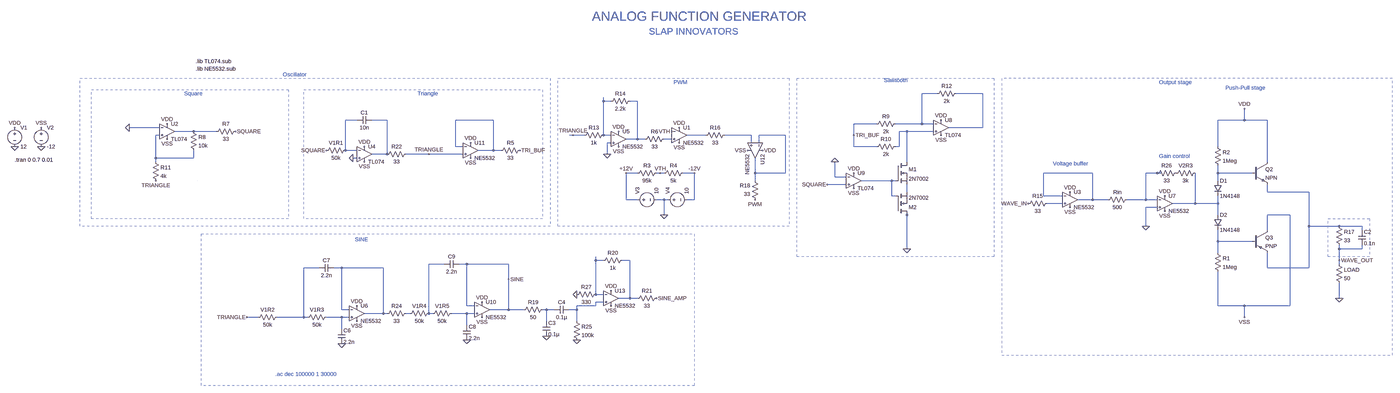
[diagram p0: schematic Function Generator Schematic.asc, whole sheet]
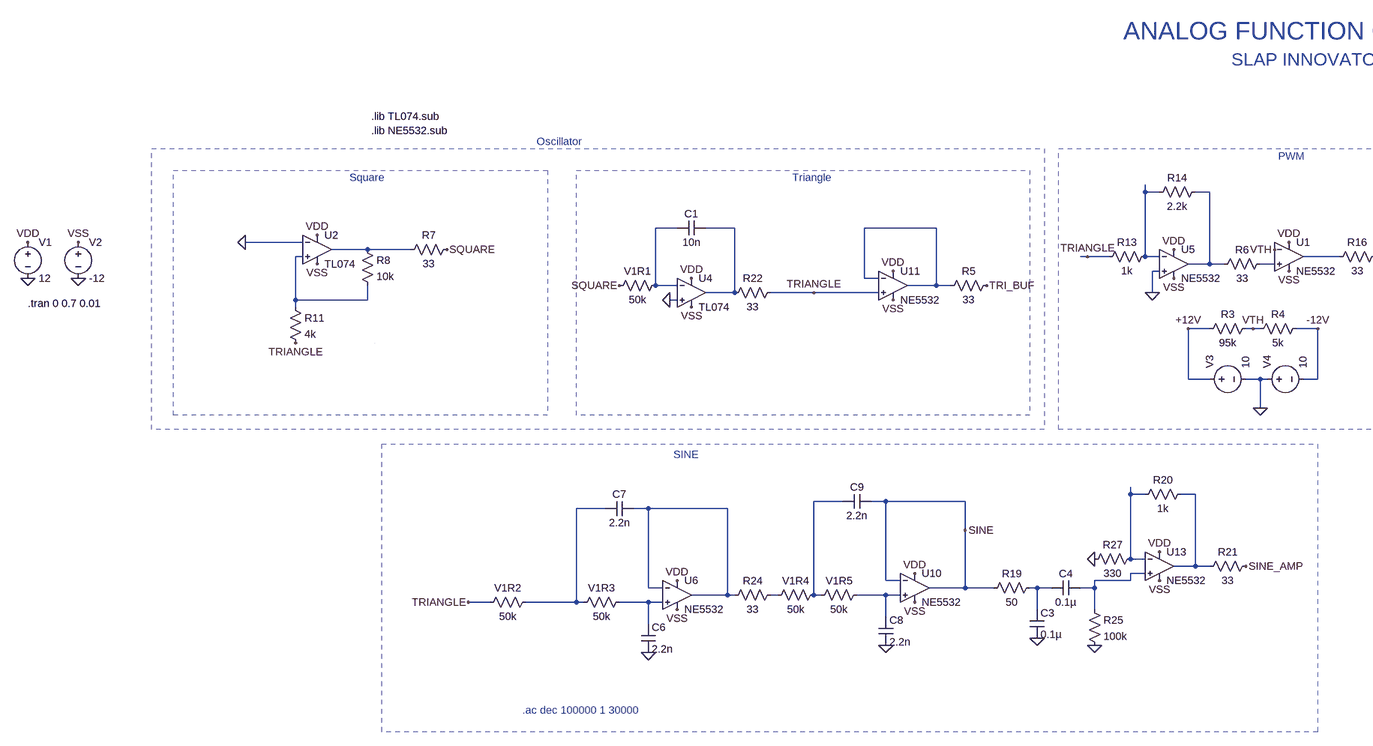
[diagram p1: schematic Function Generator Schematic.asc, part, row 1 of 1, column 1 of 2]
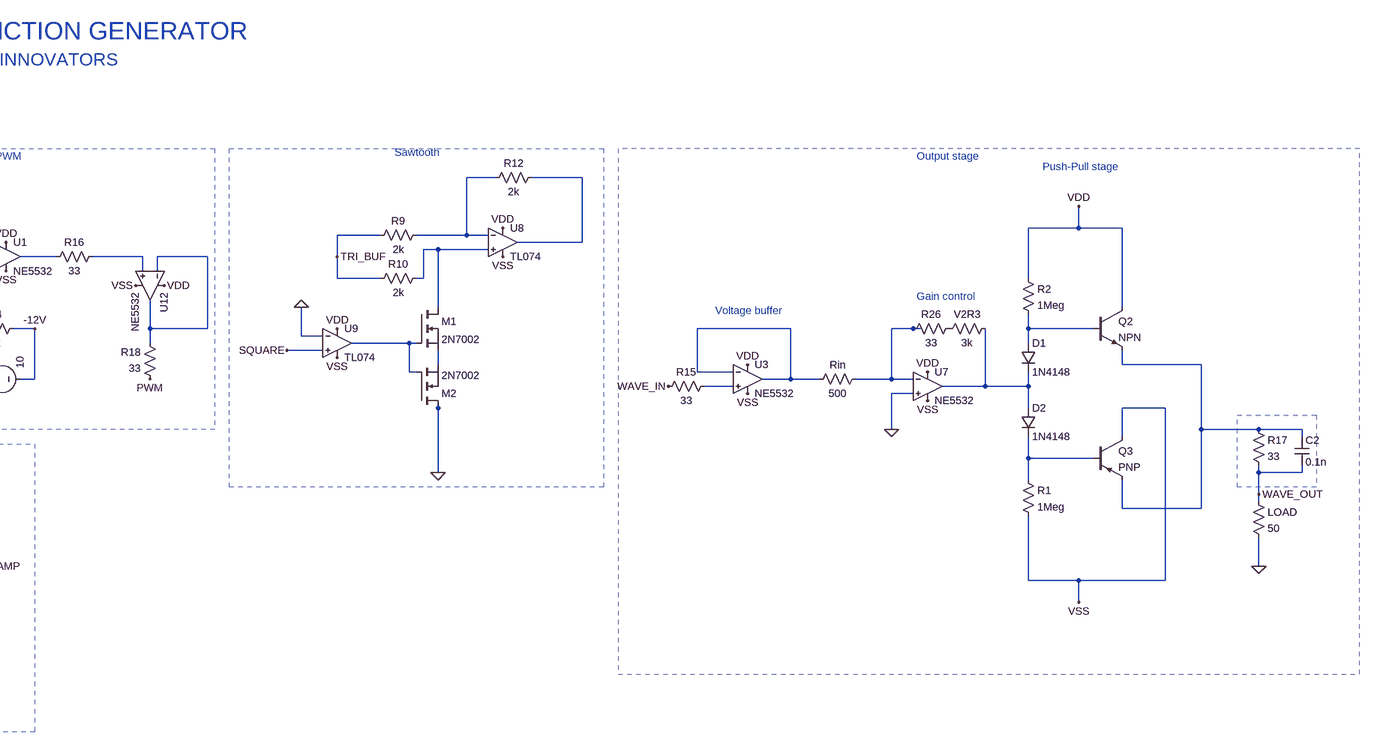
[diagram p2: schematic Function Generator Schematic.asc, part, row 1 of 1, column 2 of 2]
Function Generator Schematic.asc, the LTspice schematic file:
Version 4
SHEET 1 4996 1420
WIRE 2912 0 2848 0
WIRE 3104 0 2992 0
WIRE 1504 32 1504 16
WIRE 1536 32 1504 32
WIRE 1648 32 1616 32
WIRE 464 112 416 112
WIRE 592 112 528 112
WIRE 1040 112 880 112
WIRE 4208 112 4208 64
WIRE 4208 112 4096 112
WIRE 4304 112 4208 112
WIRE 2656 128 2560 128
WIRE 2848 128 2848 0
WIRE 2848 128 2736 128
WIRE 2896 128 2848 128
WIRE -368 144 -496 144
WIRE 3104 144 3104 0
WIRE 3104 144 2960 144
WIRE -224 160 -304 160
WIRE -128 160 -224 160
WIRE 2784 160 2752 160
WIRE 2896 160 2784 160
WIRE -368 176 -384 176
WIRE 1376 176 1360 176
WIRE 1424 176 1376 176
WIRE 1504 176 1504 32
WIRE 1536 176 1504 176
WIRE 1936 176 1856 176
WIRE 2128 176 2016 176
WIRE 2272 176 2160 176
WIRE 2560 176 2560 128
WIRE 1648 192 1648 32
WIRE 1648 192 1600 192
WIRE 1680 192 1648 192
WIRE 1792 192 1760 192
WIRE 1536 208 1520 208
WIRE 2128 208 2128 176
WIRE 2160 208 2160 176
WIRE 880 224 880 112
WIRE 912 224 880 224
WIRE 2560 224 2560 176
WIRE 2656 224 2560 224
WIRE 2752 224 2752 160
WIRE 2752 224 2736 224
WIRE 4096 224 4096 112
WIRE 416 240 416 112
WIRE 464 240 416 240
WIRE 1040 240 1040 112
WIRE 1040 240 976 240
WIRE 1072 240 1040 240
WIRE 592 256 592 112
WIRE 592 256 528 256
WIRE 768 256 672 256
WIRE 912 256 768 256
WIRE 1520 256 1520 208
WIRE -384 272 -384 176
WIRE -224 272 -224 240
WIRE -224 272 -384 272
WIRE 464 272 448 272
WIRE -384 288 -384 272
WIRE 2784 288 2784 160
WIRE 4304 288 4304 112
WIRE 1648 336 1600 336
WIRE 1744 336 1728 336
WIRE 1760 336 1744 336
WIRE 1888 336 1840 336
WIRE 2144 336 2144 272
WIRE 2272 336 2272 176
WIRE 2272 336 2144 336
WIRE 3568 336 3360 336
WIRE 3840 336 3792 336
WIRE 3856 336 3840 336
WIRE 4096 336 4096 304
WIRE 4240 336 4096 336
WIRE 2480 352 2480 288
WIRE 2528 352 2480 352
WIRE 2144 368 2144 336
WIRE 2720 368 2592 368
WIRE 2736 368 2720 368
WIRE 4096 368 4096 336
WIRE 2528 384 2448 384
WIRE 2784 416 2784 384
WIRE 4304 416 4304 384
WIRE 4480 416 4304 416
WIRE 2720 432 2720 368
WIRE 2736 432 2720 432
WIRE 3360 432 3360 336
WIRE 3440 432 3360 432
WIRE 1600 448 1600 336
WIRE 1648 448 1600 448
WIRE 1760 448 1728 448
WIRE 1776 448 1760 448
WIRE 1888 448 1888 336
WIRE 1888 448 1856 448
WIRE 3568 448 3568 336
WIRE 3568 448 3504 448
WIRE 3632 448 3568 448
WIRE 3792 448 3792 336
WIRE 3792 448 3712 448
WIRE 3840 448 3792 448
WIRE 3440 464 3376 464
WIRE 4000 464 4000 336
WIRE 4000 464 3904 464
WIRE 4096 464 4096 432
WIRE 4096 464 4000 464
WIRE 3840 480 3792 480
WIRE 1760 512 1760 448
WIRE 2784 512 2784 496
WIRE 4096 512 4096 464
WIRE 4400 512 4304 512
WIRE 3792 560 3792 480
WIRE 4480 560 4480 416
WIRE 4608 560 4480 560
WIRE 4704 560 4608 560
WIRE 4304 576 4304 512
WIRE 4704 576 4704 560
WIRE 4096 624 4096 576
WIRE 4240 624 4096 624
WIRE 2784 656 2784 512
WIRE 4608 656 4608 640
WIRE 4704 656 4704 640
WIRE 4704 656 4608 656
WIRE 4096 672 4096 624
WIRE 1472 704 1472 688
WIRE 1504 704 1472 704
WIRE 1616 704 1584 704
WIRE 4608 704 4608 656
WIRE 832 720 768 720
WIRE 928 720 896 720
WIRE 1104 720 928 720
WIRE 4608 720 4608 704
WIRE 304 736 240 736
WIRE 400 736 368 736
WIRE 576 736 400 736
WIRE 4304 736 4304 672
WIRE 4480 736 4480 560
WIRE 4480 736 4304 736
WIRE 1104 784 1104 720
WIRE 1472 848 1472 704
WIRE 1504 848 1472 848
WIRE 1616 864 1616 704
WIRE 1616 864 1568 864
WIRE 1648 864 1616 864
WIRE 4608 864 4608 800
WIRE 1504 880 1472 880
WIRE 928 896 928 720
WIRE 960 896 928 896
WIRE 1472 896 1472 880
WIRE 1472 896 1392 896
WIRE 4096 896 4096 752
WIRE 4208 896 4096 896
WIRE 4400 896 4400 512
WIRE 4400 896 4208 896
WIRE 400 912 400 736
WIRE 432 912 400 912
WIRE 1104 912 1104 784
WIRE 1104 912 1024 912
WIRE 1168 912 1104 912
WIRE 1264 912 1248 912
WIRE 1296 912 1264 912
WIRE 1392 912 1392 896
WIRE 1392 912 1360 912
WIRE 576 928 576 736
WIRE 576 928 496 928
WIRE 592 928 576 928
WIRE 688 928 672 928
WIRE 768 928 768 720
WIRE 784 928 768 928
WIRE 928 928 864 928
WIRE 960 928 928 928
WIRE 48 944 0 944
WIRE 240 944 240 736
WIRE 240 944 128 944
WIRE 256 944 240 944
WIRE 400 944 336 944
WIRE 432 944 400 944
WIRE 4208 944 4208 896
WIRE 1264 960 1264 912
WIRE 1392 960 1392 912
WIRE 928 976 928 928
WIRE 400 992 400 944
FLAG -912 224 0
FLAG -1024 224 0
FLAG -1024 144 VDD
FLAG -912 144 VSS
FLAG 496 224 VDD
FLAG 496 288 VSS
FLAG 1760 512 0
FLAG 1744 336 VTH
FLAG 1376 176 TRIANGLE
FLAG 336 240 SQUARE
FLAG -336 128 VDD
FLAG -336 192 VSS
FLAG -496 144 0
FLAG -384 368 TRIANGLE
FLAG 448 272 0
FLAG 1824 144 VDD
FLAG 1824 208 VSS
FLAG 1792 160 VTH
FLAG 1568 160 VDD
FLAG 1568 224 VSS
FLAG 2928 112 VDD
FLAG 2928 176 VSS
FLAG 2560 336 VDD
FLAG 2560 400 VSS
FLAG 2448 384 SQUARE
FLAG 2480 288 0
FLAG 2784 656 0
FLAG 1520 256 0
FLAG 1600 336 +12V
FLAG 1888 336 -12V
FLAG 464 896 VDD
FLAG 464 960 VSS
FLAG 400 1056 0
FLAG 992 880 VDD
FLAG 992 944 VSS
FLAG 928 1040 0
FLAG 1104 784 SINE
FLAG 768 256 TRIANGLE
FLAG 3792 560 0
FLAG 3472 416 VDD
FLAG 3472 480 VSS
FLAG 3872 496 VSS
FLAG 3872 432 VDD
FLAG 4608 864 0
FLAG 4208 64 VDD
FLAG 4208 944 VSS
FLAG 2144 448 PWM
FLAG 0 944 TRIANGLE
FLAG 2176 240 VDD
FLAG 2112 240 VSS
FLAG 2560 176 TRI_BUF
FLAG 1536 832 VDD
FLAG 1536 896 VSS
FLAG 1728 864 SINE_AMP
FLAG -48 160 SQUARE
FLAG 1392 1040 0
FLAG 1264 1024 0
FLAG 1392 848 0
FLAG 944 208 VDD
FLAG 944 272 VSS
FLAG 1152 240 TRI_BUF
FLAG 3296 464 WAVE_IN
FLAG 4608 704 WAVE_OUT
SYMBOL voltage -1024 128 R0
WINDOW 123 0 0 Left 0
WINDOW 39 0 0 Left 0
SYMATTR InstName V1
SYMATTR Value 12
SYMBOL voltage -912 128 R0
WINDOW 123 0 0 Left 0
WINDOW 39 0 0 Left 0
SYMATTR InstName V2
SYMATTR Value -12
SYMBOL cap 528 96 R90
WINDOW 0 0 32 VBottom 2
WINDOW 3 32 32 VTop 2
SYMATTR InstName C1
SYMATTR Value 10n
SYMBOL voltage 1632 448 R270
WINDOW 123 0 0 Left 0
WINDOW 39 0 0 Left 0
SYMATTR InstName V3
SYMATTR Value 10
SYMBOL voltage 1760 448 R270
WINDOW 123 0 0 Left 0
WINDOW 39 0 0 Left 0
SYMATTR InstName V4
SYMATTR Value 10
SYMBOL res 1632 352 R270
WINDOW 0 32 56 VTop 2
WINDOW 3 0 56 VBottom 2
SYMATTR InstName R3
SYMATTR Value 95k
SYMBOL res 1744 352 R270
WINDOW 0 32 56 VTop 2
WINDOW 3 0 56 VBottom 2
SYMATTR InstName R4
SYMATTR Value 5k
SYMBOL OpAmps\\opamp2 496 192 R0
SYMATTR InstName U4
SYMATTR Value TL074
SYMBOL res -240 144 R0
SYMATTR InstName R8
SYMATTR Value 10k
SYMBOL res -400 272 R0
SYMATTR InstName R11
SYMATTR Value 4k
SYMBOL OpAmps\\opamp2 -336 96 R0
SYMATTR InstName U2
SYMATTR Value TL074
SYMBOL OpAmps\\opamp2 1824 112 R0
SYMATTR InstName U1
SYMATTR Value NE5532
SYMBOL OpAmps\\opamp2 1568 128 R0
SYMATTR InstName U5
SYMATTR Value NE5532
SYMBOL OpAmps\\opamp2 2928 80 R0
SYMATTR InstName U8
SYMATTR Value TL074
SYMBOL res 2752 112 R90
WINDOW 0 0 56 VBottom 2
WINDOW 3 32 56 VTop 2
SYMATTR InstName R9
SYMATTR Value 2k
SYMBOL res 2752 208 R90
WINDOW 0 0 56 VBottom 2
WINDOW 3 32 56 VTop 2
SYMATTR InstName R10
SYMATTR Value 2k
SYMBOL OpAmps\\opamp2 2560 304 R0
SYMATTR InstName U9
SYMATTR Value TL074
SYMBOL res 3008 -16 R90
WINDOW 0 0 56 VBottom 2
WINDOW 3 32 56 VTop 2
SYMATTR InstName R12
SYMATTR Value 2k
SYMBOL res 1520 160 R90
WINDOW 0 0 56 VBottom 2
WINDOW 3 32 56 VTop 2
SYMATTR InstName R13
SYMATTR Value 1k
SYMBOL res 1632 16 R90
WINDOW 0 0 56 VBottom 2
WINDOW 3 32 56 VTop 2
SYMATTR InstName R14
SYMATTR Value 2.2k
SYMBOL OpAmps\\opamp2 464 864 R0
SYMATTR InstName U6
SYMATTR Value NE5532
SYMBOL res 352 928 R90
WINDOW 0 0 56 VBottom 2
WINDOW 3 32 56 VTop 2
SYMATTR InstName V1R3
SYMATTR Value 50k
SYMBOL cap 384 992 R0
SYMATTR InstName C6
SYMATTR Value 2.2n
SYMBOL cap 368 720 R90
WINDOW 0 0 32 VBottom 2
WINDOW 3 32 32 VTop 2
SYMATTR InstName C7
SYMATTR Value 2.2n
SYMBOL res 144 928 R90
WINDOW 0 0 56 VBottom 2
WINDOW 3 32 56 VTop 2
SYMATTR InstName V1R2
SYMATTR Value 50k
SYMBOL OpAmps\\opamp2 992 848 R0
SYMATTR InstName U10
SYMATTR Value NE5532
SYMBOL res 880 912 R90
WINDOW 0 0 56 VBottom 2
WINDOW 3 32 56 VTop 2
SYMATTR InstName V1R5
SYMATTR Value 50k
SYMBOL cap 912 976 R0
SYMATTR InstName C8
SYMATTR Value 2.2n
SYMBOL cap 896 704 R90
WINDOW 0 0 32 VBottom 2
WINDOW 3 32 32 VTop 2
SYMATTR InstName C9
SYMATTR Value 2.2n
SYMBOL res 784 912 R90
WINDOW 0 0 56 VBottom 2
WINDOW 3 32 56 VTop 2
SYMATTR InstName V1R4
SYMATTR Value 50k
SYMBOL OpAmps\\opamp2 3472 384 R0
SYMATTR InstName U3
SYMATTR Value NE5532
SYMBOL OpAmps\\opamp2 3872 400 R0
SYMATTR InstName U7
SYMATTR Value NE5532
SYMBOL res 3728 432 R90
WINDOW 0 0 56 VBottom 2
WINDOW 3 32 56 VTop 2
SYMATTR InstName Rin
SYMATTR Value 500
SYMBOL res 4016 320 R90
WINDOW 0 0 56 VBottom 2
WINDOW 3 32 56 VTop 2
SYMATTR InstName V2R3
SYMATTR Value 3k
SYMBOL diode 4080 368 R0
SYMATTR InstName D1
SYMATTR Value 1N4148
SYMBOL diode 4080 512 R0
SYMATTR InstName D2
SYMATTR Value 1N4148
SYMBOL npn 4240 288 R0
SYMATTR InstName Q2
SYMBOL pnp 4240 576 R0
SYMATTR InstName Q3
SYMBOL res 4080 656 R0
SYMATTR InstName R1
SYMATTR Value 1Meg
SYMBOL res 4080 208 R0
SYMATTR InstName R2
SYMATTR Value 1Meg
SYMBOL res 4592 704 R0
SYMATTR InstName LOAD
SYMATTR Value 50
SYMBOL res 1776 176 R90
WINDOW 0 0 56 VBottom 2
WINDOW 3 32 56 VTop 2
SYMATTR InstName R6
SYMATTR Value 33
SYMBOL res 3392 448 R90
WINDOW 0 0 56 VBottom 2
WINDOW 3 32 56 VTop 2
SYMATTR InstName R15
SYMATTR Value 33
SYMBOL res 2032 160 R90
WINDOW 0 0 56 VBottom 2
WINDOW 3 32 56 VTop 2
SYMATTR InstName R16
SYMATTR Value 33
SYMBOL res 4592 544 R0
SYMATTR InstName R17
SYMATTR Value 33
SYMBOL cap 4688 576 R0
SYMATTR InstName C2
SYMATTR Value 0.1n
SYMBOL nmos 2736 288 R0
SYMATTR InstName M1
SYMATTR Value 2N7002
SYMBOL nmos 2736 512 M180
SYMATTR InstName M2
SYMATTR Value 2N7002
SYMBOL OpAmps\\opamp2 2208 240 R90
SYMATTR InstName U12
SYMATTR Value NE5532
SYMBOL res 2160 464 R180
WINDOW 0 36 76 Left 2
WINDOW 3 36 40 Left 2
SYMATTR InstName R18
SYMATTR Value 33
SYMBOL OpAmps\\opamp2 1536 800 R0
SYMATTR InstName U13
SYMATTR Value NE5532
SYMBOL res 1600 688 R90
WINDOW 0 0 56 VBottom 2
WINDOW 3 32 56 VTop 2
SYMATTR InstName R20
SYMATTR Value 1k
SYMBOL res 1744 848 R90
WINDOW 0 0 56 VBottom 2
WINDOW 3 32 56 VTop 2
SYMATTR InstName R21
SYMATTR Value 33
SYMBOL res -32 144 R90
WINDOW 0 0 56 VBottom 2
WINDOW 3 32 56 VTop 2
SYMATTR InstName R7
SYMATTR Value 33
SYMBOL res 688 240 R90
WINDOW 0 0 56 VBottom 2
WINDOW 3 32 56 VTop 2
SYMATTR InstName R22
SYMATTR Value 33
SYMBOL res 688 912 R90
WINDOW 0 0 56 VBottom 2
WINDOW 3 32 56 VTop 2
SYMATTR InstName R24
SYMATTR Value 33
SYMBOL res 1264 896 R90
WINDOW 0 0 56 VBottom 2
WINDOW 3 32 56 VTop 2
SYMATTR InstName R19
SYMATTR Value 50
SYMBOL cap 1248 960 R0
SYMATTR InstName C3
SYMATTR Value 0.1µ
SYMBOL cap 1360 896 R90
WINDOW 0 0 32 VBottom 2
WINDOW 3 32 32 VTop 2
SYMATTR InstName C4
SYMATTR Value 0.1µ
SYMBOL res 1376 944 R0
SYMATTR InstName R25
SYMATTR Value 100k
SYMBOL res 3936 320 R90
WINDOW 0 0 56 VBottom 2
WINDOW 3 32 56 VTop 2
SYMATTR InstName R26
SYMATTR Value 33
SYMBOL res 1488 832 R90
WINDOW 0 0 56 VBottom 2
WINDOW 3 32 56 VTop 2
SYMATTR InstName R27
SYMATTR Value 330
SYMBOL res 432 224 R90
WINDOW 0 0 56 VBottom 2
WINDOW 3 32 56 VTop 2
SYMATTR InstName V1R1
SYMATTR Value 50k
SYMBOL OpAmps\\opamp2 944 176 R0
SYMATTR InstName U11
SYMATTR Value NE5532
SYMBOL res 1168 224 R90
WINDOW 0 0 56 VBottom 2
WINDOW 3 32 56 VTop 2
SYMATTR InstName R5
SYMATTR Value 33
TEXT -1024 280 Left 2 !.tran 0 0.7 0.01
TEXT -216 -104 Left 2 !.lib NE5532.sub
TEXT 152 -80 Left 2 ;Oscillator
TEXT -264 0 Left 2 ;Square
TEXT 720 0 Left 2 ;Triangle
TEXT 1800 -48 Left 2 ;PWM
TEXT -216 -136 Left 2 !.lib TL074.sub
TEXT 456 616 Left 2 ;SINE
TEXT 120 1184 Left 2 ;.ac dec 100000 1 30000
TEXT 3400 296 Left 2 ;Voltage buffer
TEXT 3848 264 Left 2 ;Gain control
TEXT 4128 -24 Left 2 ;Push-Pull stage
TEXT 3848 -48 Left 2 ;Output stage
TEXT 2688 -56 Left 2 ;Sawtooth
TEXT 1456 -528 Left 5 ;ANALOG FUNCTION GENERATOR
TEXT 1696 -464 Left 4 ;SLAP INNOVATORS
LINE Normal -208 368 -208 368 2
RECTANGLE Normal 176 528 -656 -16 2
RECTANGLE Normal 240 -16 240 -16 2
RECTANGLE Normal 3184 1104 4832 -64 2
RECTANGLE Normal 4736 688 4560 528 2
RECTANGLE Normal 1248 528 240 -16 2
RECTANGLE Normal -704 -64 1280 560 2
RECTANGLE Normal 1888 1232 -192 592 2
RECTANGLE Normal 2288 560 1312 -64 2
RECTANGLE Normal 3152 688 2320 -64 2

The netlist it stands for:
* Function Generator Schematic.asc
V1 VDD 0 12
V2 VSS 0 -12
C1 N006 N005 10n
V3 +12V 0 10
V4 0 -12V 10
R3 +12V VTH 95k
R4 VTH -12V 5k
XU4 0 N005 VDD VSS N006 TL074  ; pins In+ In- V+ V- OUT
R8 N008 N010 10k
R11 N010 TRIANGLE 4k
XU2 N010 0 VDD VSS N008 TL074  ; pins In+ In- V+ V- OUT
XU1 N014 VTH VDD VSS N011 NE5532  ; pins In+ In- V+ V- OUT
XU5 0 N003 VDD VSS N004 NE5532  ; pins In+ In- V+ V- OUT
XU8 N009 N001 VDD VSS N002 TL074  ; pins In+ In- V+ V- OUT
R9 N001 TRI_BUF 2k
R10 N009 TRI_BUF 2k
XU9 SQUARE 0 VDD VSS N018 TL074  ; pins In+ In- V+ V- OUT
R12 N002 N001 2k
R13 N003 TRIANGLE 1k
R14 N004 N003 2.2k
XU6 N033 N028 VDD VSS N028 NE5532  ; pins In+ In- V+ V- OUT
R§V1R3 N033 N027 50k
C6 N033 0 2.2n
C7 N028 N027 2.2n
R§V1R2 N027 TRIANGLE 50k
XU10 N032 SINE VDD VSS SINE NE5532  ; pins In+ In- V+ V- OUT
R§V1R5 N032 N026 50k
C8 N032 0 2.2n
C9 SINE N026 2.2n
R§V1R4 N026 N031 50k
XU3 N021 N015 VDD VSS N015 NE5532  ; pins In+ In- V+ V- OUT
XU7 0 N016 VDD VSS N022 NE5532  ; pins In+ In- V+ V- OUT
Rin N016 N015 500
R§V2R3 N022 P001 3k
D1 N017 N022 1N4148
D2 N022 N023 1N4148
Q2 VDD N017 N020 0 NPN
Q3 VSS N023 N020 0 PNP
R1 N023 VSS 1Meg
R2 VDD N017 1Meg
R§LOAD WAVE_OUT 0 50
R6 N014 N004 33
R15 N021 WAVE_IN 33
R16 N012 N011 33
R17 N020 WAVE_OUT 33
C2 N020 WAVE_OUT 0.1n
M1 N009 N018 N019 N019 2N7002
M2 0 N018 N019 N019 2N7002
XU12 N012 N013 VDD VSS N013 NE5532  ; pins In+ In- V+ V- OUT
R18 PWM N013 33
XU13 N029 N024 VDD VSS N025 NE5532  ; pins In+ In- V+ V- OUT
R20 N025 N024 1k
R21 SINE_AMP N025 33
R7 SQUARE N008 33
R22 TRIANGLE N006 33
R24 N031 N028 33
R19 N030 SINE 50
C3 N030 0 0.1µ
C4 N029 N030 0.1µ
R25 N029 0 100k
R26 P001 N016 33
R27 N024 0 330
R§V1R1 N005 SQUARE 50k
XU11 TRIANGLE N007 VDD VSS N007 NE5532  ; pins In+ In- V+ V- OUT
R5 TRI_BUF N007 33
.model D D
.lib standard.dio
.model NPN NPN
.model PNP PNP
.lib standard.bjt
.model NMOS NMOS
.model PMOS PMOS
.lib standard.mos
.tran 0 0.7 0.01
.lib NE5532.sub
* Oscillator
* Square
* Triangle
* PWM
.lib TL074.sub
* SINE
* .ac dec 100000 1 30000
* Voltage buffer
* Gain control
* Push-Pull stage
* Output stage
* Sawtooth
* ANALOG FUNCTION GENERATOR
* SLAP INNOVATORS
.backanno
.end